# EAGLE design 125_38kHz IR (EAGLE 9.6.2)
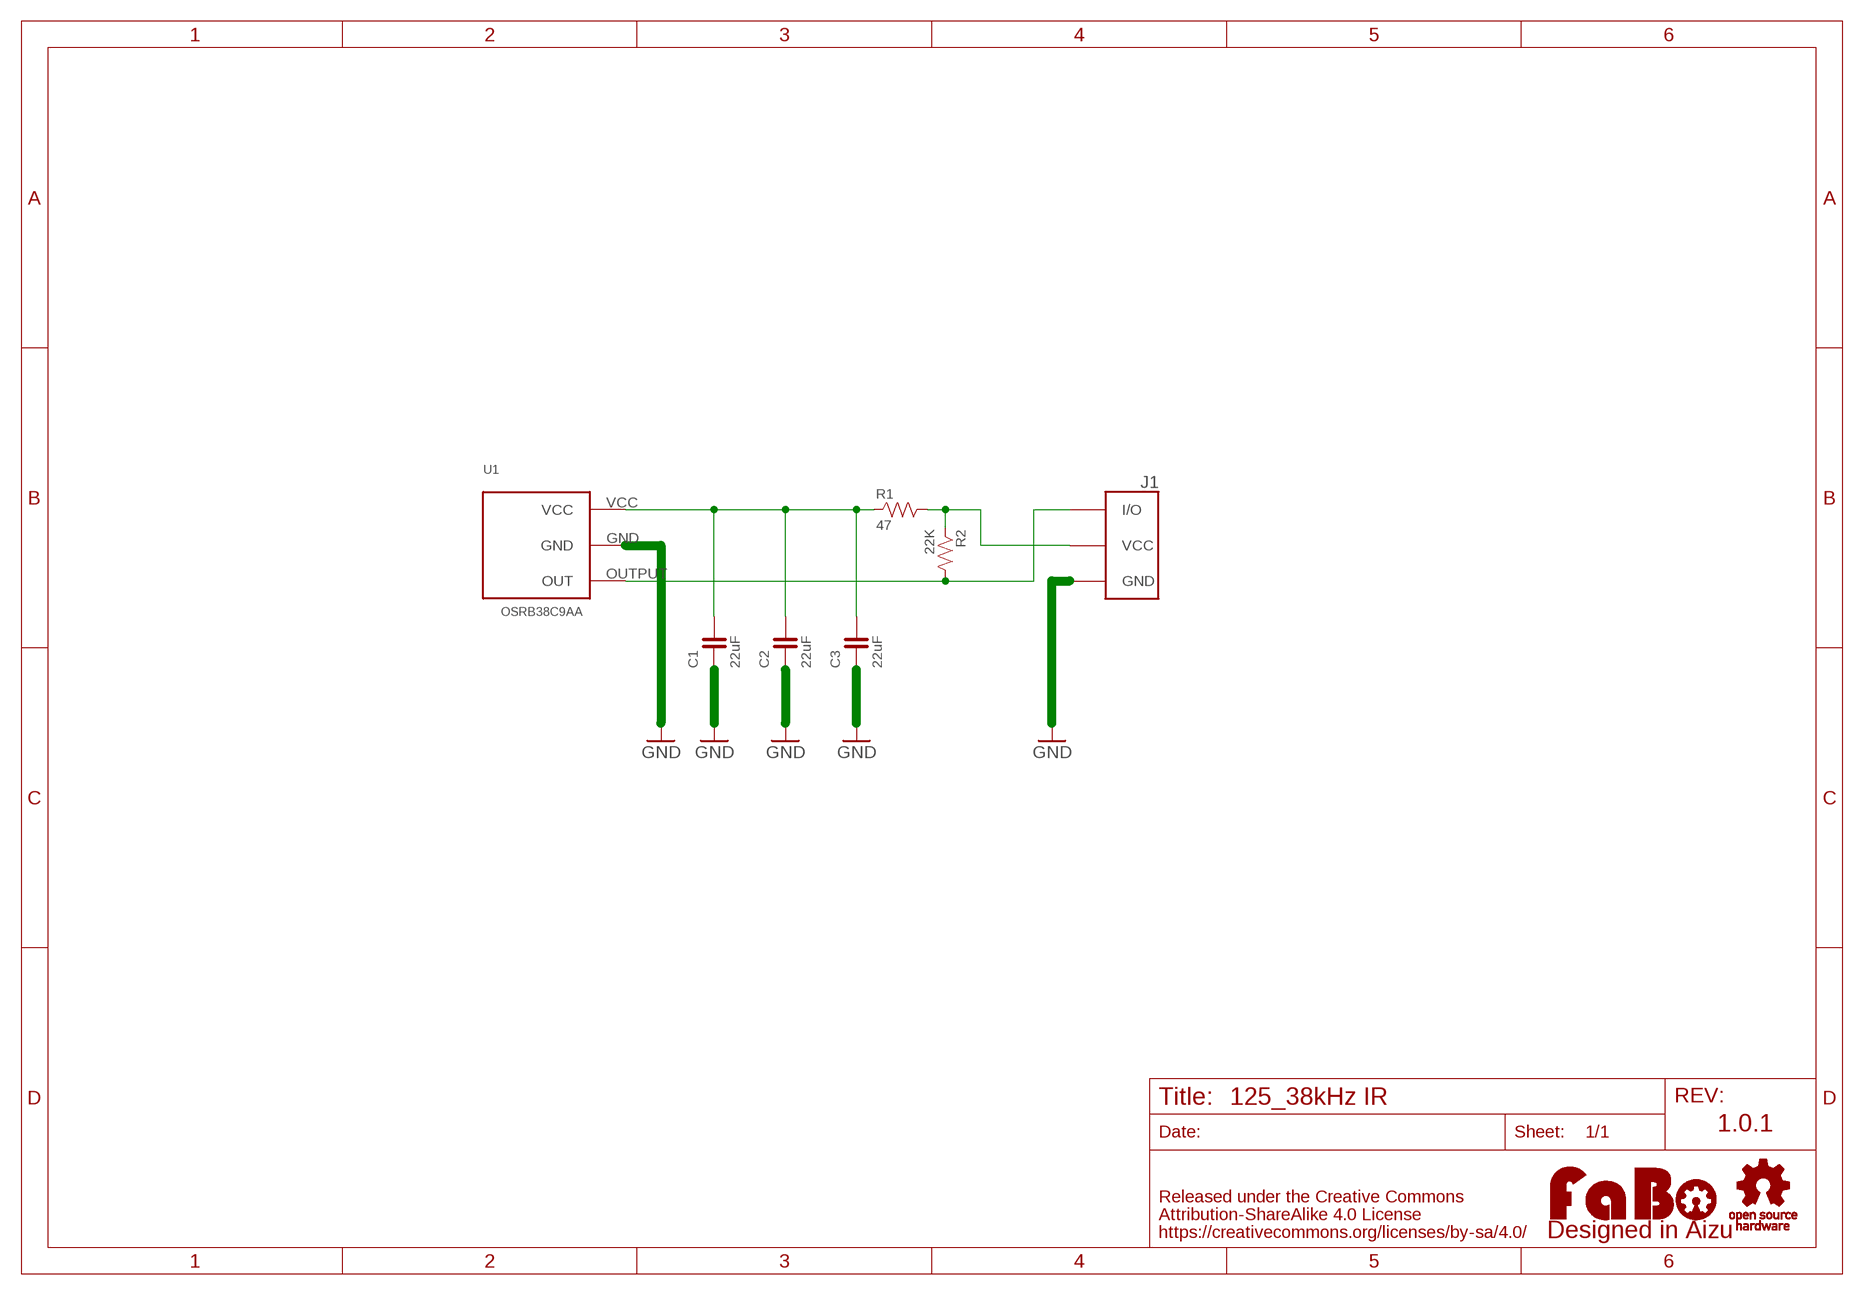
[diagram p0: schematic, sheet 1]

## Parts
C1  22uF  CAPACITOR-0805  [0805]
C2  22uF  CAPACITOR-0805  [0805]
C3  22uF  CAPACITOR-0805  [0805]
J1  FABO_BRICK_3PIN  [FABO_BRICK_3PIN]
LOGO1  LOGO_FABO-M  [LOGO_FABO_M]
R1  47  RESISTOR-0603  [0603]
R2  22K  RESISTOR-0603  [0603]
U1  OSRB38C9AA  [OSRB38C9AA]
U$2  LOGO_OSHW-M  [LOGO_OSHW_M]

## Nets
GND: C1.1 C2.1 C3.1 J1.GND U1.GND
N$1: C1.2 C2.2 C3.2 R1.1 U1.VCC
N$2: J1.VCC R1.2 R2.1
N$4: J1.I/O R2.2 U1.OUTPUT(OUT)

## Notes on the sheet
- 1.0.1

## Library data of the parts
C1-C3 = FaBo-Capacitor:CAPACITOR: CAPACITOR
J1 = FaBo-Template:FABO_BRICK_3PIN: FaBo Brick 3pin
LOGO1 = component:LOGO_FABO
R1 R2 = FaBo-Resistors:RESISTOR: RESISTOR
U1 = FaBo-etc:OSRB38C9AA
U$2 = FaBo-etc:LOGO_OSHW

## Board
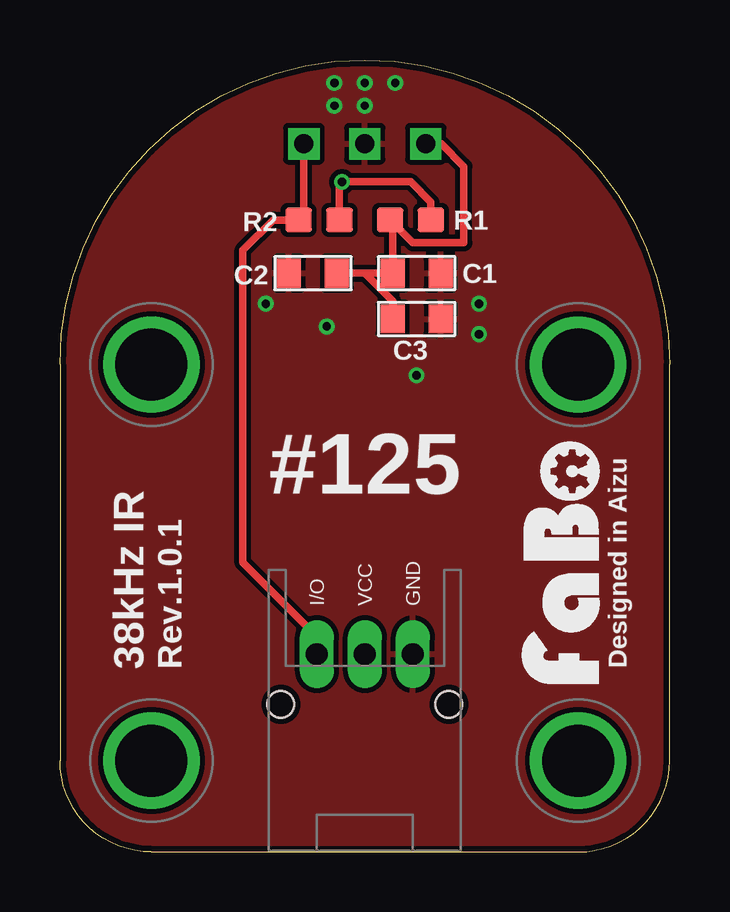
[diagram p1: board, top side]
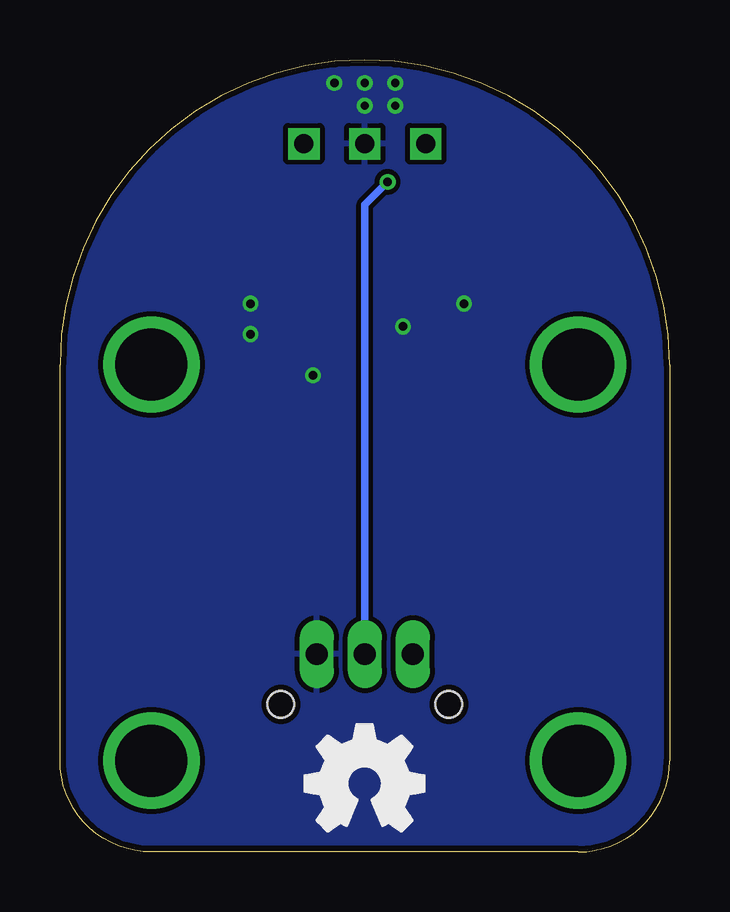
[diagram p2: board, bottom side, seen from below]

Size 25.4 x 33.02 mm. Coordinates in mm from the lower left corner, seen from the top.
Copper layers (1*16): Top 0.035mm / dielectric 1.6mm / Bottom 0.035mm
Design rules "PCBway": minimum track width 6mil, minimum drill 12mil, track to track 6mil, track to pad 6mil, pad to pad 6mil, via to via 6mil, smd to smd 6mil, copper to edge 10mil, drill to drill 10mil, minimum pad ring 10mil, minimum via ring 6mil, stop-mask expansion 2mil, vias tented up to drill 100mil, thermal gap 8mil

### Footprints (pad centres in the part's own frame; a part is rotated, then mirrored left to right if it is on the bottom)
0805 = smd 1 x 1.2: 1 -1.254,0; 2 0.746,0
FABO_BRICK_3PIN = drill 0.9 pad 1.422 long: GND 2,-8.255; I/O -2,-8.255; VCC 0,-8.255 | drill 3 pad 3.81: P$1 -8.89,3.81; P$2 8.89,3.81; P$3 -8.89,-12.7; P$4 8.89,-12.7 | hole 1.1: -3.5,-10.355; 3.5,-10.355
0603 = smd 1.1 x 1: 1 -0.85,0; 2 0.85,0
OSRB38C9AA = drill 0.8 square: GND 0,0; OUTPUT -2.54,0; VCC 2.54,0

### Placement (x,y rotation side)
C1  14.61,24.13 180 top
C2  10.79,24.13 0 top
C3  14.61,22.23 180 top
J1  12.7,16.51 0 top
LOGO1  22.86,12.06 90 top
R1  14.61,26.35 0 top
R2  10.79,26.35 180 top
U1  12.7,29.53 0 top
U$2  12.7,2.86 0 bottom

### Tracks (layer width: path | path; a pad name or v marks a point on that pad's centre or on a via)
GND  (via drill 0.35)
  Top 0.305: C1.1 15.88,24.13 15.86,24.11
  other vias: 14.86,19.88 8.57,22.86 11.11,21.91 17.46,22.86 17.46,21.59 12.7,31.11 11.43,31.11 11.43,32.07 12.7,32.07 13.97,32.07
  pour Bottom (isolate 0.203): 0,0 25.4,0 25.4,33.02 0,33.02
  pour Top (isolate 0.203): 0,0 25.4,0 25.4,33.02 0,33.02
N$1
  Top 0.305: C2.2 12.7,24.13 | 12.7,24.13 C1.2 13.86,26.25 R1.1 14.71,25.4 16.83,25.4 16.83,28.57 15.88,29.53 U1.VCC | 12.7,24.13 13.86,22.97 C3.2 | 12.7,24.13
N$2  (via drill 0.35)
  Top 0.305: R2.1 11.64,27.84 v11.75,27.94 14.61,27.94 15.46,27.09 R1.2
  Bottom 0.305: J1.VCC 12.7,26.99 v11.75,27.94
N$4
  Top 0.305: J1.I/O 10.7,8.98 7.62,12.06 7.62,25.08 8.89,26.35 R2.2 10.16,26.57 U1.OUTPUT

### Text on the board
tPlace: #125 | Designed in Aizu | 38kHz IR | Rev.1.0.1